# EAGLE schematic HC-SR04 v1 (EAGLE 9.7.0)
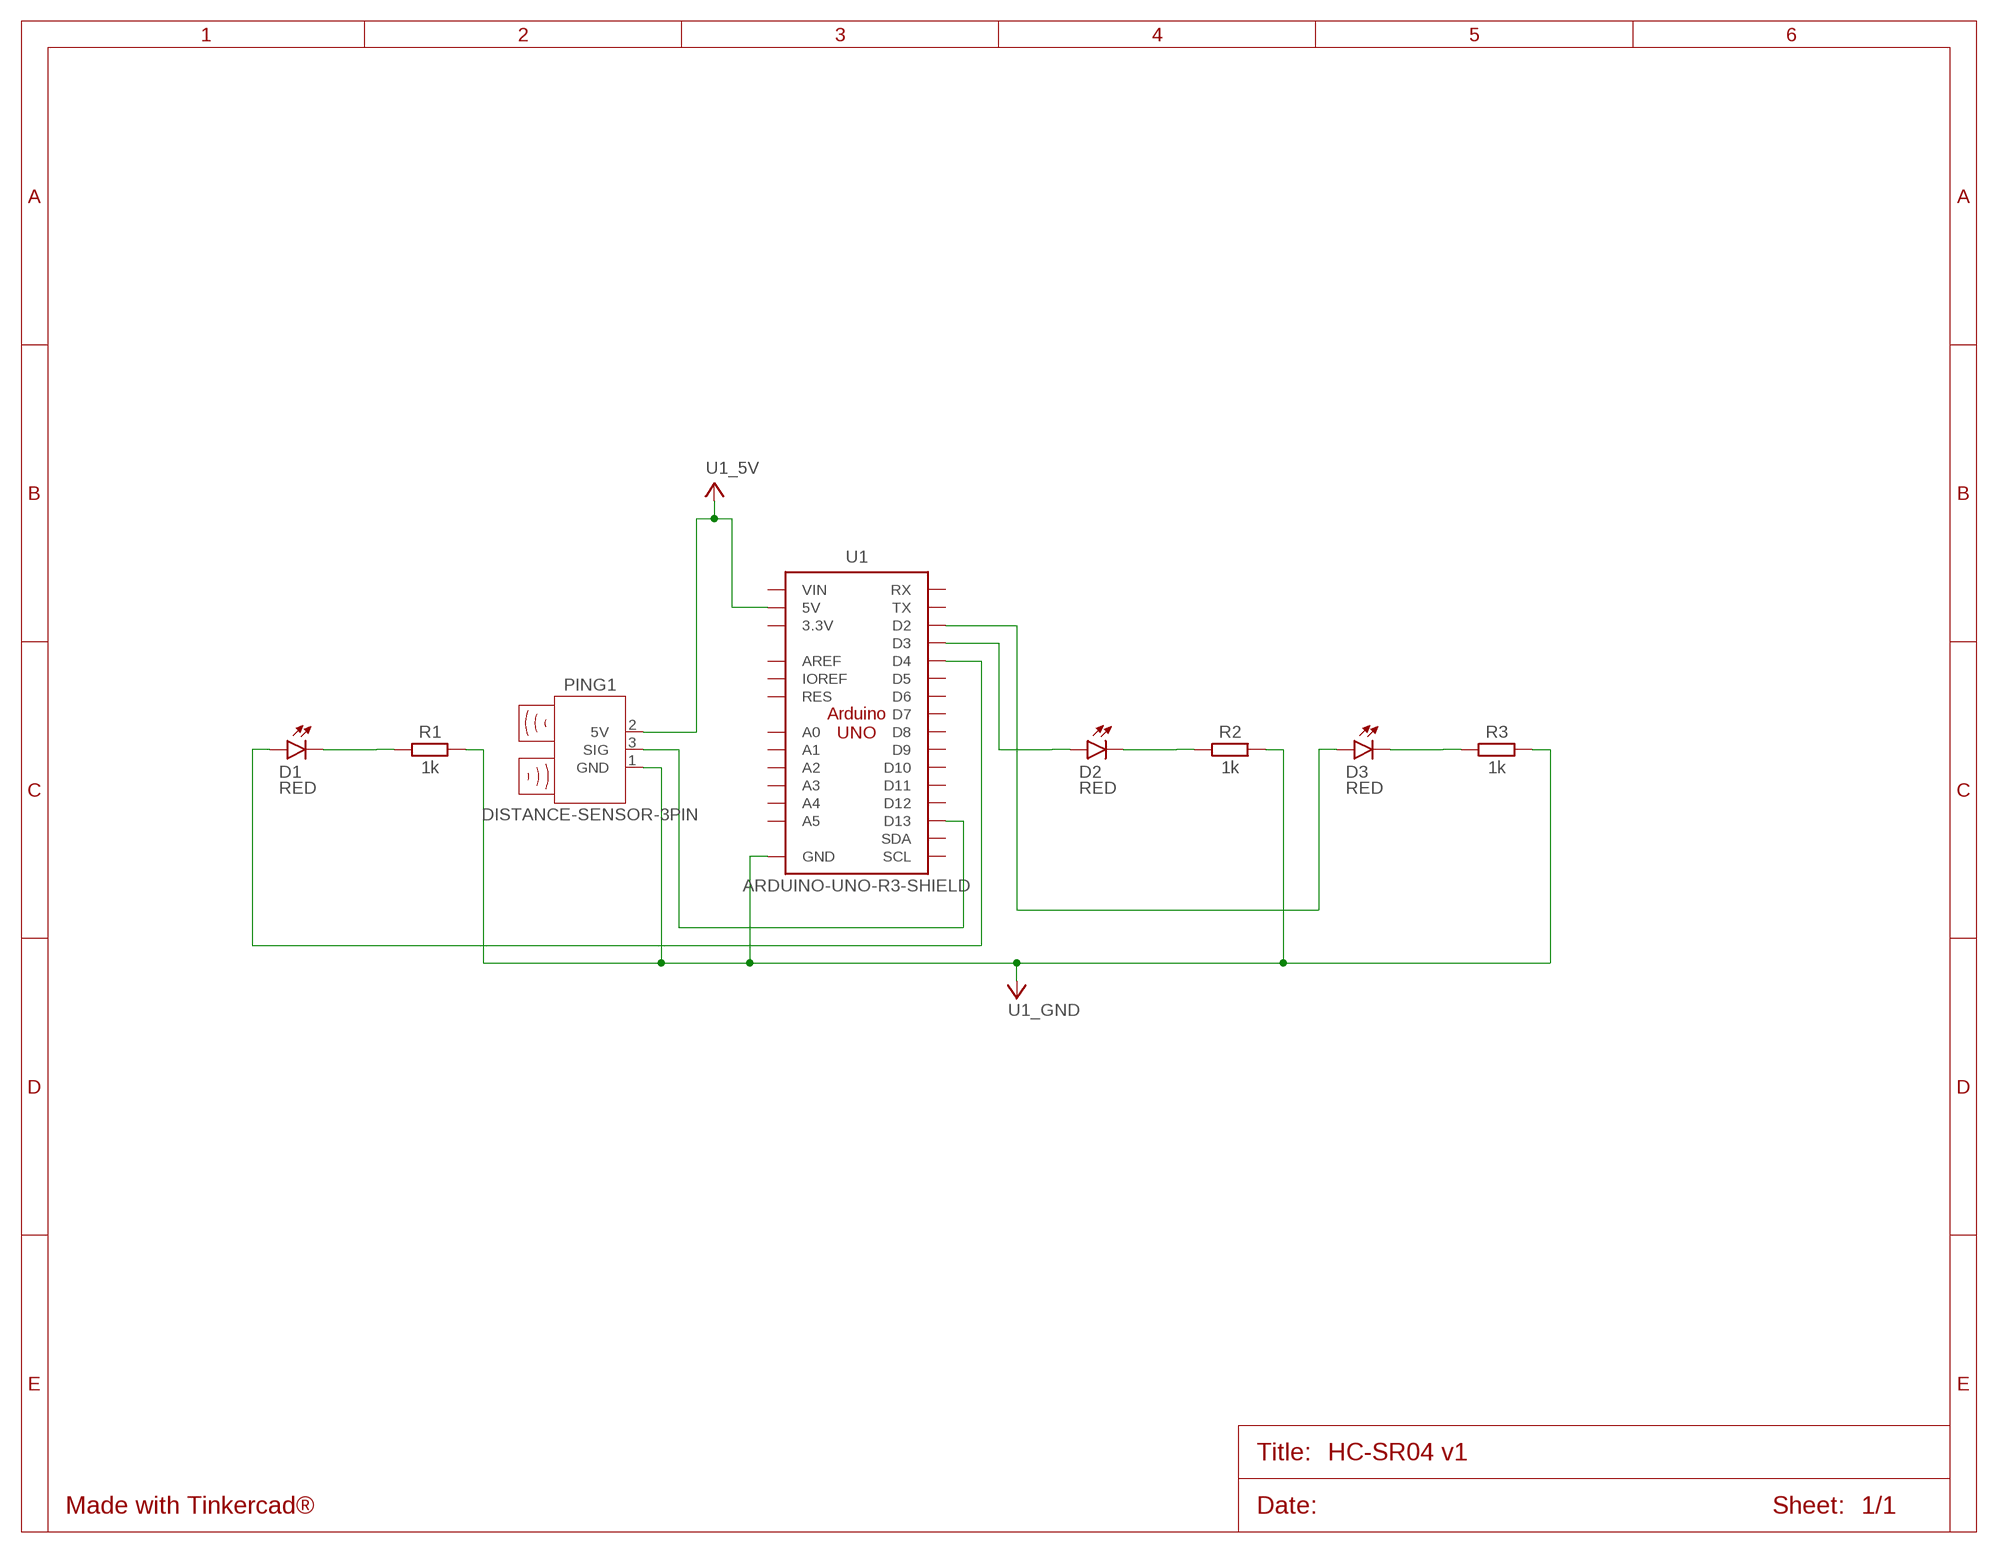
[diagram p0: schematic, sheet 1]

## Parts
D1  RED  LED_RADIAL_RED  [LEDRD254W60D565H860B]
D2  RED  LED_RADIAL_RED  [LEDRD254W60D565H860B]
D3  RED  LED_RADIAL_RED  [LEDRD254W60D565H860B]
PING1  DISTANCE-SENSOR-3PIN  [28015]
R1  1k  RESISTOR_AXIAL-10.16MM-PITCH  [RESAD1016W63L850D250B]
R2  1k  RESISTOR_AXIAL-10.16MM-PITCH  [RESAD1016W63L850D250B]
R3  1k  RESISTOR_AXIAL-10.16MM-PITCH  [RESAD1016W63L850D250B]
U1  ARDUINO-UNO-R3-SHIELD  [ARDUINO-UNO-R3-SHIELD]

## Nets
D1_C: D1.2(C) R1.2
D2_C: D2.2(C) R2.2
D3_C: D3.2(C) R3.2
U1_5V: PING1.2(5V) U1.5V
U1_D2: D3.1(A) U1.D2
U1_D3: D2.1(A) U1.D3
U1_D4: D1.1(A) U1.D4
U1_D13: PING1.3(SIG) U1.D13
U1_GND: PING1.1(GND) R1.1 R2.1 R3.1 U1.GND@0(GND) U1.GND@1(GND) U1.GND@2(GND)
Unconnected: U1.3.3V U1.A0 U1.A1 U1.A2 U1.A3 U1.A4 U1.A5 U1.AREF U1.D5 U1.D6 U1.D7 U1.D8 U1.D9 U1.D10 U1.D11 U1.D12 U1.IOREF U1.RES U1.RX U1.SCL U1.SDA U1.TX U1.VIN

## Library data of the parts
D1-D3 = Tinkercad:LED_RADIAL: LED - Generic; CATEGORY: Opto-Electronic; SUB-CATEGORY: LED; VALUE: LED_RED
PING1 = Tinkercad:DISTANCE-SENSOR-3PIN
R1-R3 = Tinkercad:RESISTOR: Resistor Fixed - Generic
U1 = Tinkercad:ARDUINO-UNO-R3-SHIELD